# EAGLE design KSR_CDTV-SCSI30a (EAGLE 7.7.0)
REVISION: 0.1
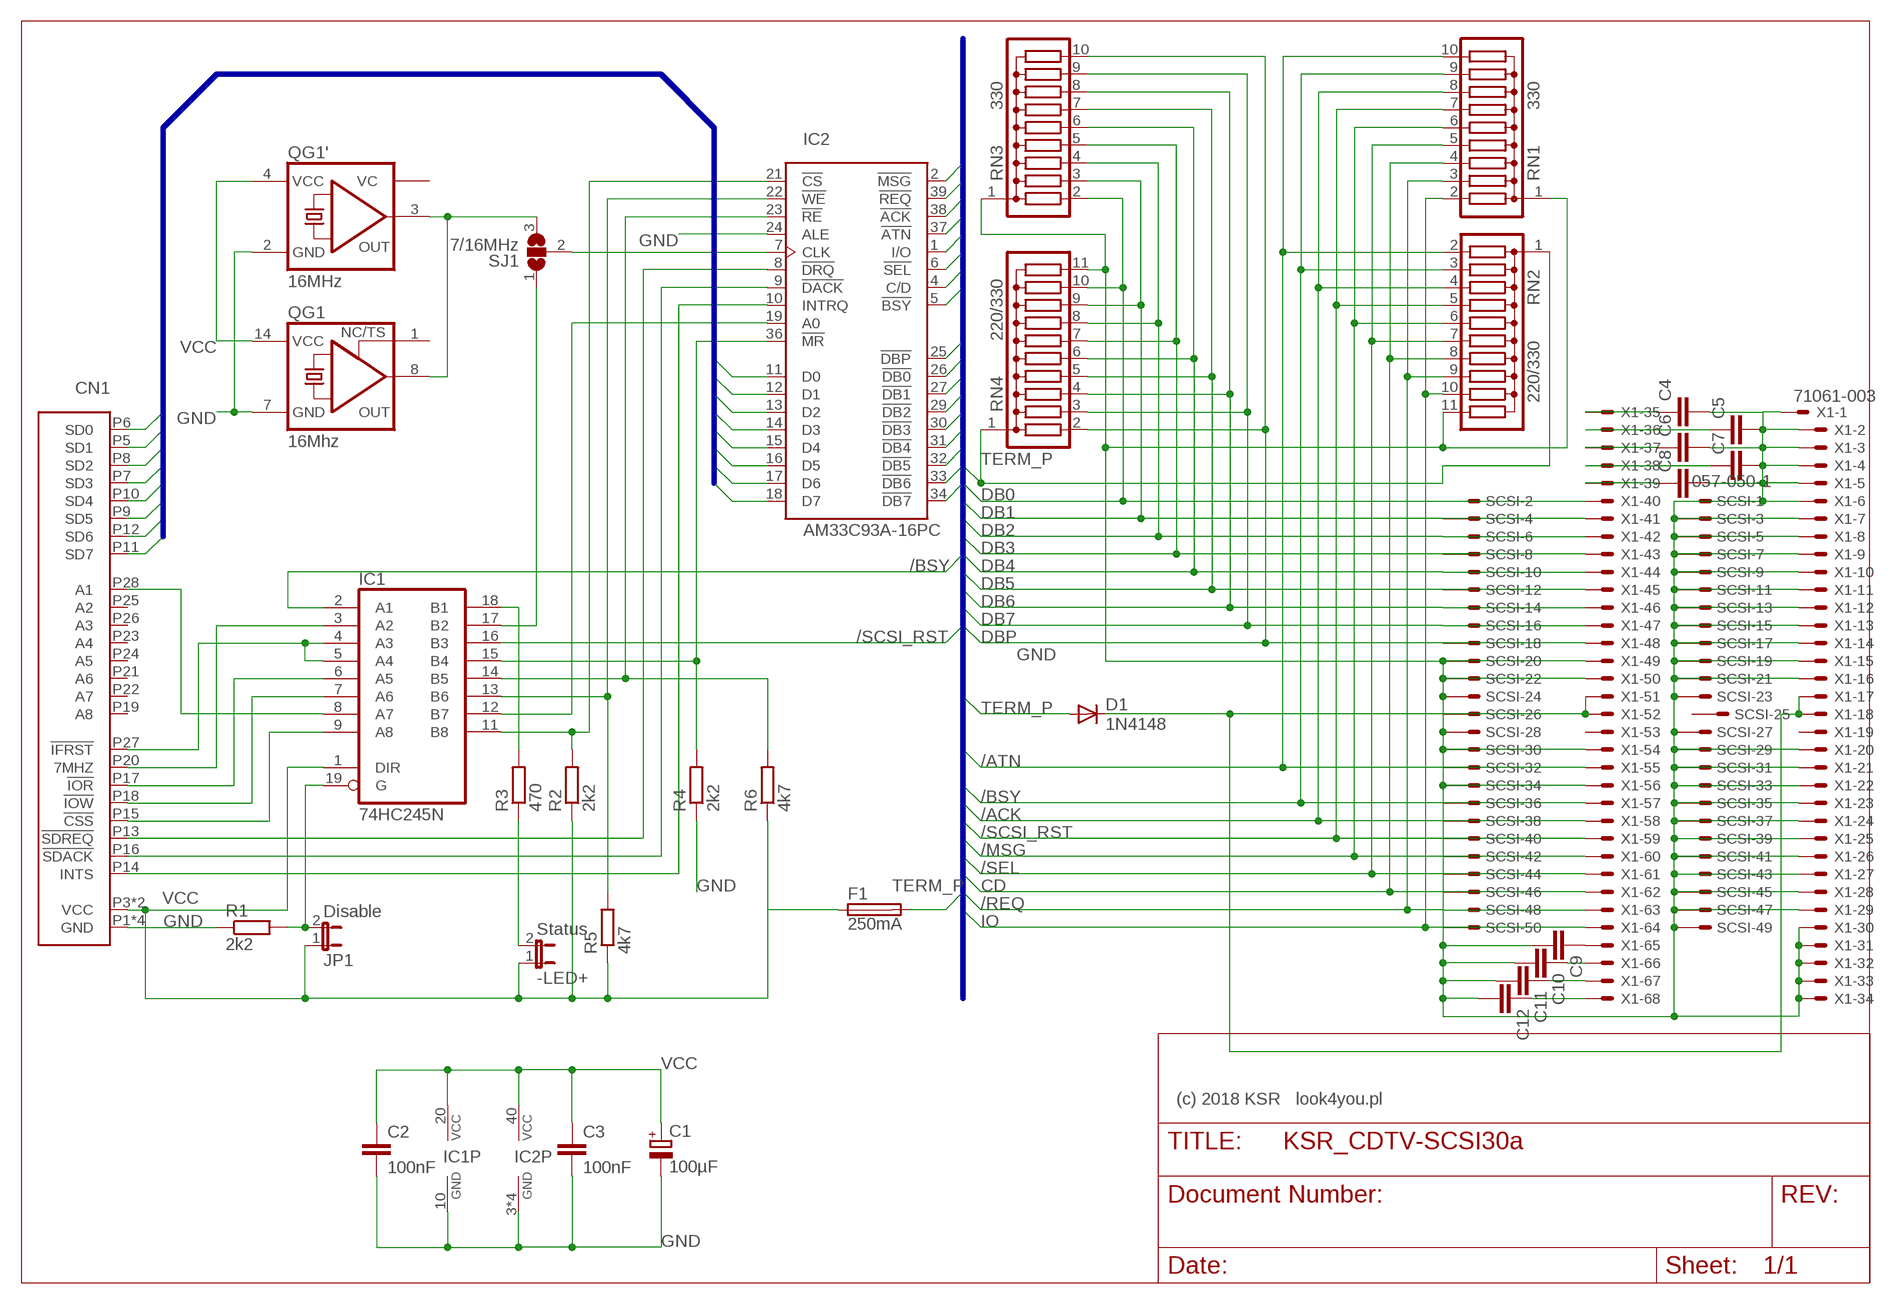
[diagram p0: schematic, sheet 1]

## Parts
-LED+  Status  JP1E  [JP1]
C1  100µF  CPOL-EUE2,5-6E  [E2,5-6E]
C2  100nF  C-EU050-025X075  [C050-025X075]
C3  100nF  C-EU050-025X075  [C050-025X075]
C4  C-EUC0603  [C0603]
C5  C-EUC0603  [C0603]
C6  C-EUC0603  [C0603]
C7  C-EUC0603  [C0603]
C8  C-EUC0603  [C0603]
C9  C-EUC0603  [C0603]
C10  C-EUC0603  [C0603]
C11  C-EUC0603  [C0603]
C12  C-EUC0603  [C0603]
CN1  CDTV-EXPANSION  [CDTV-SLOT]
D1  1N4148  1N4148DO35-7  [DO35-7]
F1  250mA  FUSETE5  [TE5]
IC1  74HC245N  [DIL20]
IC2  AM33C93A-16PC  WD33C93  [DIP40-6]
JP1  Disable  JP1E  [JP1]
QG1  16Mhz  XO-14  [DIL14S]
QG1'  16MHz  TCXO-CFPT-126  [7.0X5.0-4-PAD]
R1  2k2  R-EU_0207/7  [0207/7]
R2  2k2  R-EU_0207/7  [0207/7]
R3  470  R-EU_0207/7  [0207/7]
R4  2k2  R-EU_0207/7  [0207/7]
R5  4k7  R-EU_0207/7  [0207/7]
R6  4k7  R-EU_0207/7  [0207/7]
RN1  330  G09R  [SIL10]
RN2  220/330  G10R  [SIL11]
RN3  330  G09R  [SIL10]
RN4  220/330  G10R  [SIL11]
SCSI  057-050-1  [057-050-1]
SJ1  7/16MHz  SJ2W  [SJ_2]
X1  71061-003  [71061-0003]

## Nets
7MHZ: CN1.P20(7MHZ) IC1.3(A2)
/ACK: IC2.38(!ACK) RN1.8 RN2.4 SCSI.38 X1.58
/ATN: IC2.37(!ATN) RN1.10 RN2.2 SCSI.32 X1.55
/BSY: IC1.2(A1) IC2.5(!BSY) RN1.9 RN2.3 SCSI.36 X1.57
/BSY_B: -LED+.2 R3.1
/CS: IC1.11(B8) IC2.21(!CS) R2.2
/CSS: CN1.P15(!CSS) IC1.9(A8)
/ENABLE: IC1.19(G) JP1.2 R1.2
/IFRST: CN1.P27(!IFRST) IC1.4(A3) IC1.5(A4)
/INTS: CN1.P14(INTS) IC2.10(INTRQ)
/IOR: CN1.P17(!IOR) IC1.6(A5)
/IOW: CN1.P18(!IOW) IC1.7(A6)
/MR: IC1.15(B4) IC2.36(!MR) R4.2
/MSG: IC2.2(!MSG) RN1.6 RN2.6 SCSI.42 X1.60
/RE: IC1.14(B5) IC2.23(!RE) R6.2
/REQ: IC2.39(!REQ) RN1.3 RN2.9 SCSI.48 X1.63
/SCSI_RST: IC1.16(B3) RN1.7 RN2.5 SCSI.40 X1.59
/SDACK: CN1.P16(!SDACK) IC2.9(!DACK)
/SDREQ: CN1.P13(!SDREQ) IC2.8(!DRQ)
/SEL: IC2.6(!SEL) RN1.5 RN2.7 SCSI.44 X1.61
/WE: IC1.13(B6) IC2.22(!WE) R5.2
A1: CN1.P28(A1) IC1.8(A7)
B_A1: IC1.12(B7) IC2.19(A0)
CD: IC2.4(C/D) RN1.4 RN2.8 SCSI.46 X1.62
CLK: IC2.7(CLK) SJ1.2
CLK_7: IC1.17(B2) SJ1.1
CLK_16M: QG1'.3(OUT) QG1.8(OUT) SJ1.3
DB0: IC2.26(!DB0) RN3.2 RN4.10 SCSI.2 X1.40
DB1: IC2.27(!DB1) RN3.3 RN4.9 SCSI.4 X1.41
DB2: IC2.29(!DB2) RN3.4 RN4.8 SCSI.6 X1.42
DB3: IC2.30(!DB3) RN3.5 RN4.7 SCSI.8 X1.43
DB4: IC2.31(!DB4) RN3.6 RN4.6 SCSI.10 X1.44
DB5: IC2.32(!DB5) RN3.7 RN4.5 SCSI.12 X1.45
DB6: IC2.33(!DB6) RN3.8 RN4.4 SCSI.14 X1.46
DB7: IC2.34(!DB7) RN3.9 RN4.3 SCSI.16 X1.47
DBP: IC2.25(!DBP) RN3.10 RN4.2 SCSI.18 X1.48
GND: C1.- C2.2 C3.2 C4.2 C5.2 C6.2 C7.2 C8.2 C9.2 C10.2 C11.2 C12.2 CN1.P1(GND) CN1.P2(GND) CN1.P29(GND) CN1.P30(GND) IC1.10(GND) IC2.3(GND1) IC2.20(GND1) IC2.24(ALE) IC2.28(GND1) IC2.35(GND1) QG1'.2(GND) QG1.7(GND) R1.1 R4.1 RN1.1 RN2.11 RN3.1 RN4.11 SCSI.1 SCSI.3 SCSI.5 SCSI.7 SCSI.9 SCSI.11 SCSI.13 SCSI.15 SCSI.17 SCSI.19 SCSI.20 SCSI.21 SCSI.22 SCSI.23 SCSI.24 SCSI.27 SCSI.28 SCSI.29 SCSI.30 SCSI.31 SCSI.33 SCSI.34 SCSI.35 SCSI.37 SCSI.39 SCSI.41 SCSI.43 SCSI.45 SCSI.47 SCSI.49 X1.1 X1.2 X1.3 X1.4 X1.5 X1.6 X1.7 X1.8 X1.9 X1.10 X1.11 X1.12 X1.13 X1.14 X1.15 X1.16 X1.20 X1.21 X1.22 X1.23 X1.24 X1.25 X1.26 X1.27 X1.28 X1.29 X1.30 X1.31 X1.32 X1.33 X1.34 X1.49 X1.50 X1.54 X1.56
IO: IC2.1(I/O) RN1.2 RN2.10 SCSI.50 X1.64
N$1: IC1.18(B1) R3.2
N$2: D1.C SCSI.26 X1.17 X1.18 X1.51 X1.52
N$6: C9.1 X1.65
N$7: C10.1 X1.66
N$8: C11.1 X1.67
N$9: C12.1 X1.68
N$10: C8.1 X1.39
N$11: C7.1 X1.38
N$12: C6.1 X1.37
N$13: C5.1 X1.36
N$14: C4.1 X1.35
SD0: CN1.P6(SD0) IC2.11(D0)
SD1: CN1.P5(SD1) IC2.12(D1)
SD2: CN1.P8(SD2) IC2.13(D2)
SD3: CN1.P7(SD3) IC2.14(D3)
SD4: CN1.P10(SD4) IC2.15(D4)
SD5: CN1.P9(SD5) IC2.16(D5)
SD6: CN1.P12(SD6) IC2.17(D6)
SD7: CN1.P11(SD7) IC2.18(D7)
TERM_P: D1.A F1.2 RN2.1 RN4.1
VCC: -LED+.1 C1.+ C2.1 C3.1 CN1.P3(VCC) CN1.P4(VCC) F1.1 IC1.1(DIR) IC1.20(VCC) IC2.40(VCC1) JP1.1 QG1'.4(VCC) QG1.14(VCC) R2.1 R5.1 R6.1
Unconnected: CN1.P19(A8) CN1.P21(A6) CN1.P22(A7) CN1.P23(A4) CN1.P24(A5) CN1.P25(A2) CN1.P26(A3) QG1'.1(VC) QG1.1(TS) SCSI.25 X1.19 X1.53

## Buses
SD[0..7]
DB[0..7],/MSG,/REQ,/ACK,/ATN,IO,/SEL,CD,/BSY,DBP,TERM_P,/SCSI_RST

## Notes on the sheet
- (c) 2018 KSR   look4you.pl

## Library data of the parts
-LED+ JP1 = jumper:JP1E: JUMPER
C1 = rcl:CPOL-EU: POLARIZED CAPACITOR, European symbol
C2-C12 = rcl:C-EU: CAPACITOR, European symbol
CN1 = Amiga:CDTV-EXPANSION: Expansion Port for CDTV and A570
D1 = diode:1N4148: DIODE high speed (Philips)
F1 = fuse:FUSE: Fuse; OC_FARNELL: unknown; OC_NEWARK: unknown
IC1 = 74xx-eu:74*245: Octal BUS TRANSCEIVER, 3-state
IC2 = Amiga:WD33C93: WD33C93 -SCSI-Chip WD33C93A AM33C93 P16
QG1 = crystal:XO-: CRYSTAL; OC_FARNELL: unknown; OC_NEWARK: unknown
QG1' = IQD-Frequency-Products:TCXO: CRYSTAL RESONATOR
R1-R6 = rcl:R-EU_: RESISTOR, European symbol
RN1 RN3 = resistor-sil:G09R: SIL RESISTOR; OC_FARNELL: unknown; OC_NEWARK: unknown
RN2 RN4 = resistor-sil:G10R: SIL RESISTOR; OC_FARNELL: unknown; OC_NEWARK: unknown
SCSI = con-panduit:057-050-: CONNECTOR 50-pin series 057 contact pc board low profile headers; OC_FARNELL: unknown; OC_NEWARK: unknown
SJ1 = jumper:SJ2W: SMD solder JUMPER
X1 = con-molex:71061-003: CONNECTOR 68-pin 1.27mm (.050 inch) pitch SCSI+ unshielded receptacle right angle all plastic; OC_FARNELL: unknown; OC_NEWARK: unknown

## Board
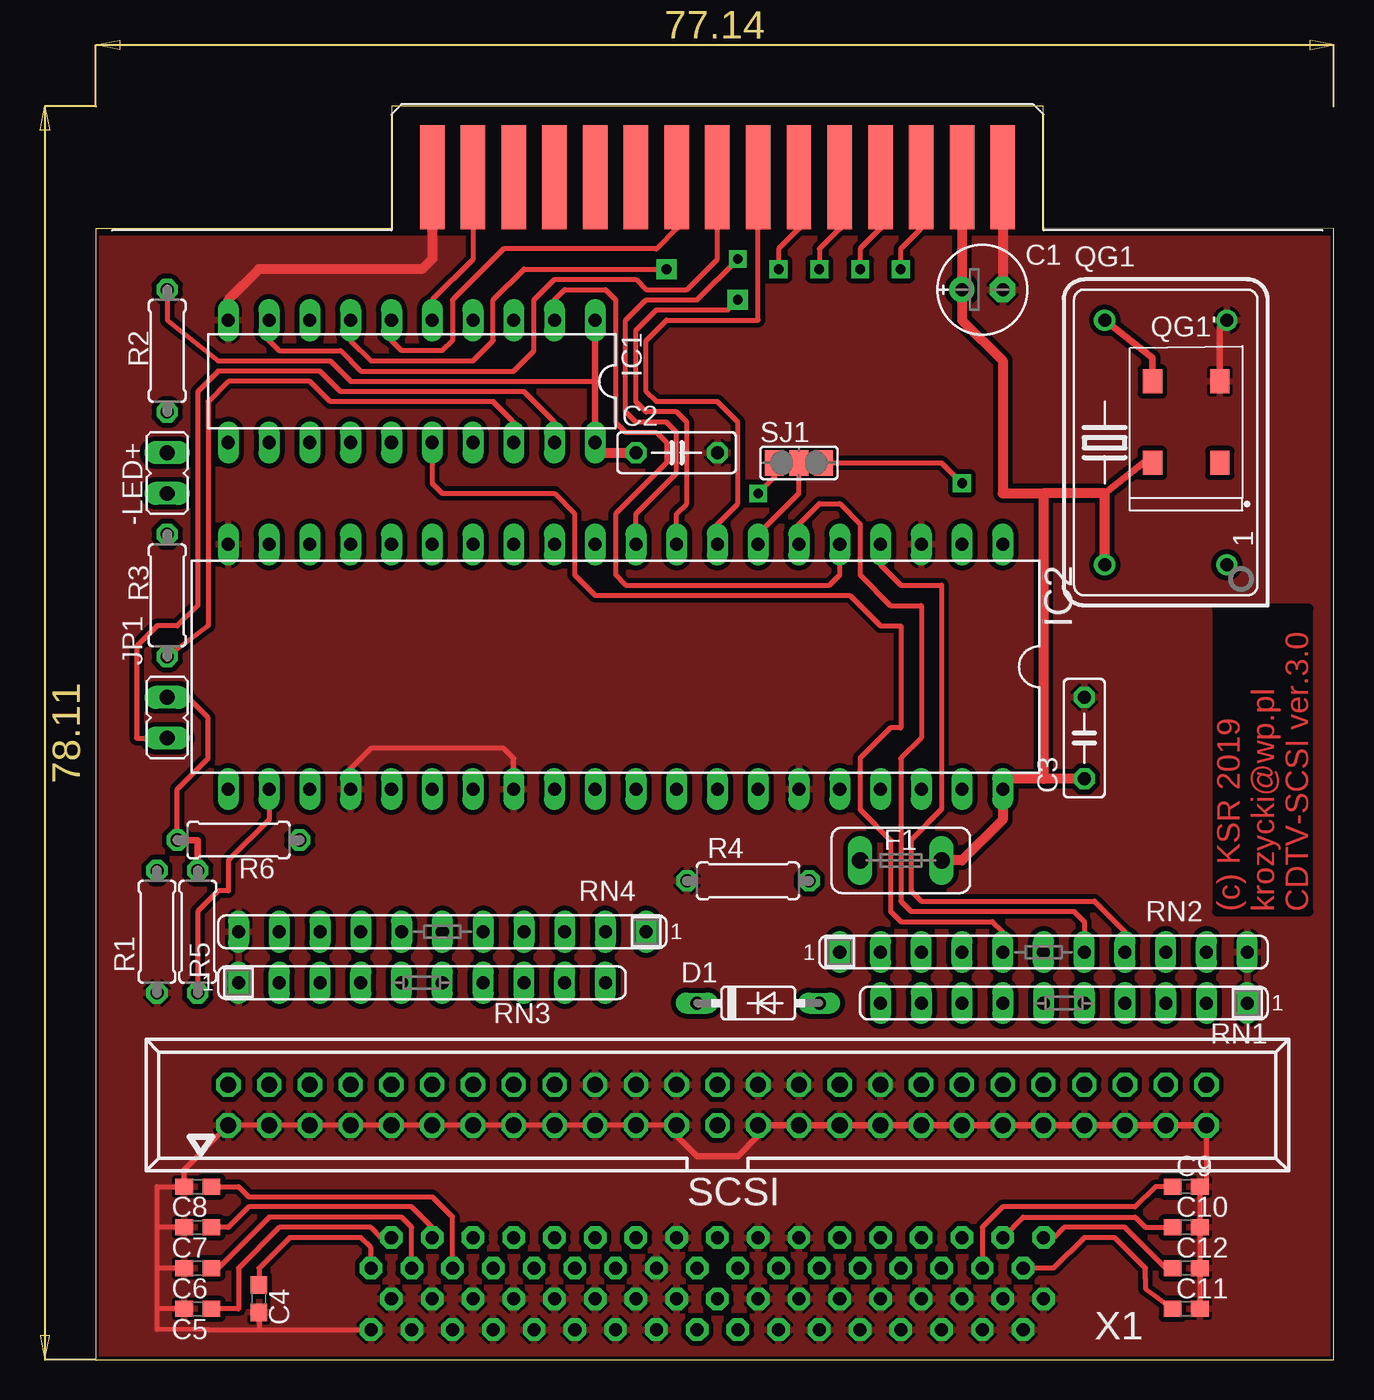
[diagram p1: board, top side]
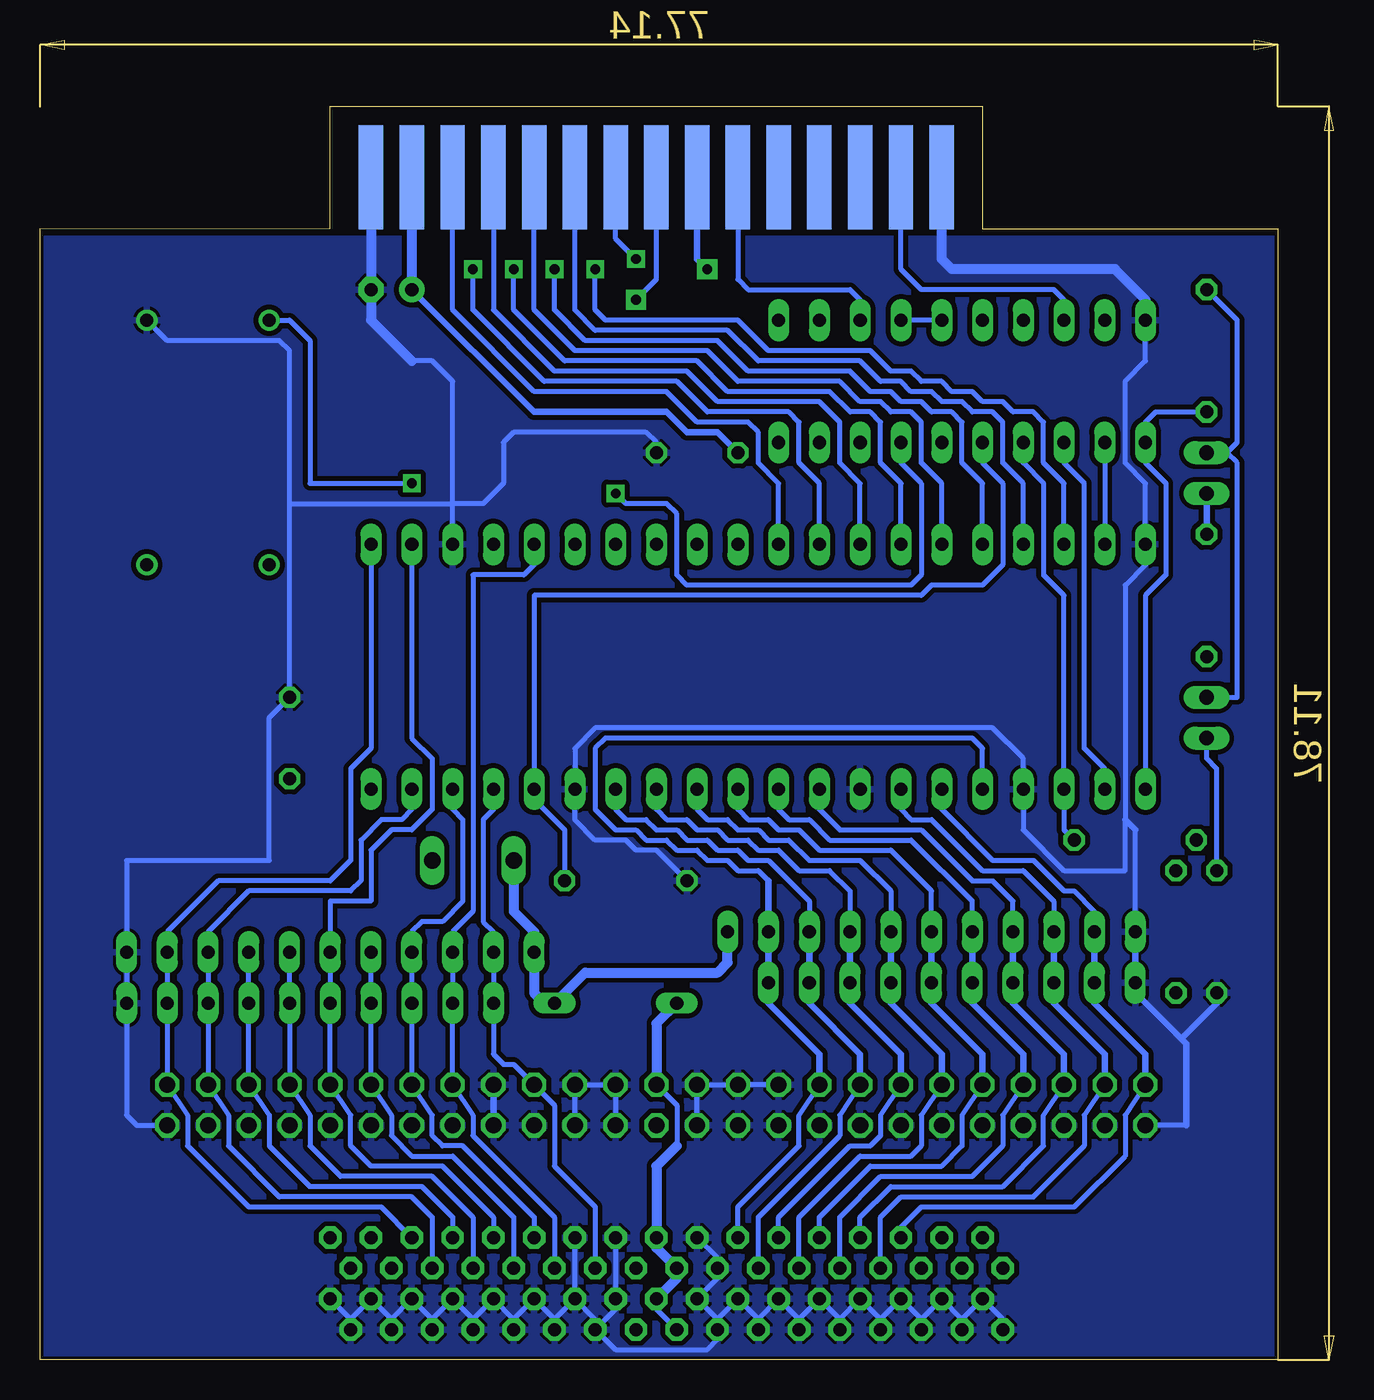
[diagram p2: board, bottom side, seen from below]

Size 77.14 x 78.11 mm. Coordinates in mm from the lower left corner, seen from the top.
Outline: 0,0 77.14,0 77.14,70.47 59.05,70.48 59.05,78.11 18.41,78.11 18.41,70.47 0,70.47 0,0
Copper layers (1*16): Top 0.035mm / dielectric 1.5mm / Bottom 0.035mm
Design rules "default *": minimum track width 10mil, minimum drill 19mil, track to track 12mil, track to pad 12mil, pad to pad 12mil, via to via 12mil, smd to smd 12mil, copper to edge 8mil, drill to drill 8mil, minimum pad ring 10mil, minimum via ring 10mil, stop-mask expansion 4mil, vias tented up to drill 0mil, thermal gap 8mil

### Footprints (pad centres in the part's own frame; a part is rotated, then mirrored left to right if it is on the bottom)
JP1 = drill 0.914 long: 1 0,-1.27; 2 0,1.27
E2,5-6E = drill 0.813 pad 1.575: + -1.27,0 | drill 0.813 pad 1.575 octagon: - 1.27,0
C050-025X075 = drill 0.813 octagon: 1 -2.54,0; 2 2.54,0
C0603 = smd 1.1 x 1: 1 -0.85,0; 2 0.85,0
CDTV-SLOT = smd 1.524 x 6.477: P1 -17.78,-2.54; P3 -15.24,-2.54; P5 -12.7,-2.54; P7 -10.16,-2.54; P9 -7.62,-2.54; P11 -5.08,-2.54; P13 -2.54,-2.54; P15 0,-2.54; P17 2.54,-2.54; P19 5.08,-2.54; P21 7.62,-2.54; P23 10.16,-2.54; P25 12.7,-2.54; P27 15.24,-2.54; P29 17.78,-2.54 | smd 1.524 x 6.477 bottom: P2 -17.78,-2.54; P4 -15.24,-2.54; P6 -12.7,-2.54; P8 -10.16,-2.54; P10 -7.62,-2.54; P12 -5.08,-2.54; P14 -2.54,-2.54; P16 0,-2.54; P18 2.54,-2.54; P20 5.08,-2.54; P22 7.62,-2.54; P24 10.16,-2.54; P26 12.7,-2.54; P28 15.24,-2.54; P30 17.78,-2.54
DO35-7 = drill 0.813 long: A 3.81,0; C -3.81,0
TE5 = drill 1.016 long: 1 -2.54,0; 2 2.54,0
DIL20 = drill 0.813 long: 1 -11.43,-3.81; 2 -8.89,-3.81; 3 -6.35,-3.81; 4 -3.81,-3.81; 5 -1.27,-3.81; 6 1.27,-3.81; 7 3.81,-3.81; 8 6.35,-3.81; 9 8.89,-3.81; 10 11.43,-3.81; 11 11.43,3.81; 12 8.89,3.81; 13 6.35,3.81; 14 3.81,3.81; 15 1.27,3.81; 16 -1.27,3.81; 17 -3.81,3.81; 18 -6.35,3.81; 19 -8.89,3.81; 20 -11.43,3.81
DIP40-6 = drill 0.813 long: 1 -24.13,-7.62; 2 -21.59,-7.62; 3 -19.05,-7.62; 4 -16.51,-7.62; 5 -13.97,-7.62; 6 -11.43,-7.62; 7 -8.89,-7.62; 8 -6.35,-7.62; 9 -3.81,-7.62; 10 -1.27,-7.62; 11 1.27,-7.62; 12 3.81,-7.62; 13 6.35,-7.62; 14 8.89,-7.62; 15 11.43,-7.62; 16 13.97,-7.62; 17 16.51,-7.62; 18 19.05,-7.62; 19 21.59,-7.62; 20 24.13,-7.62; 21 24.13,7.62; 22 21.59,7.62; 23 19.05,7.62; 24 16.51,7.62; 25 13.97,7.62; 26 11.43,7.62; 27 8.89,7.62; 28 6.35,7.62; 29 3.81,7.62; 30 1.27,7.62; 31 -1.27,7.62; 32 -3.81,7.62; 33 -6.35,7.62; 34 -8.89,7.62; 35 -11.43,7.62; 36 -13.97,7.62; 37 -16.51,7.62; 38 -19.05,7.62; 39 -21.59,7.62; 40 -24.13,7.62
DIL14S = drill 0.813: 1 -7.62,-3.81; 7 7.62,-3.81; 8 7.62,3.81; 14 -7.62,3.81
7.0X5.0-4-PAD = smd 1.5 x 1.2: 1 -2.54,-2.1; 2 2.54,-2.1; 3 2.54,2.1; 4 -2.54,2.1
0207/7 = drill 0.813 octagon: 1 -3.81,0; 2 3.81,0
SIL10 = drill 0.813 long: 1 -11.43,0; 2 -8.89,0; 3 -6.35,0; 4 -3.81,0; 5 -1.27,0; 6 1.27,0; 7 3.81,0; 8 6.35,0; 9 8.89,0; 10 11.43,0
SIL11 = drill 0.813 long: 1 -12.7,0; 2 -10.16,0; 3 -7.62,0; 4 -5.08,0; 5 -2.54,0; 6 0,0; 7 2.54,0; 8 5.08,0; 9 7.62,0; 10 10.16,0; 11 12.7,0
057-050-1 = drill 1 octagon: 1 -30.48,-1.27; 2 -30.48,1.27; 3 -27.94,-1.27; 4 -27.94,1.27; 5 -25.4,-1.27; 6 -25.4,1.27; 7 -22.86,-1.27; 8 -22.86,1.27; 9 -20.32,-1.27; 10 -20.32,1.27; 11 -17.78,-1.27; 12 -17.78,1.27; 13 -15.24,-1.27; 14 -15.24,1.27; 15 -12.7,-1.27; 16 -12.7,1.27; 17 -10.16,-1.27; 18 -10.16,1.27; 19 -7.62,-1.27; 20 -7.62,1.27; 21 -5.08,-1.27; 22 -5.08,1.27; 23 -2.54,-1.27; 24 -2.54,1.27; 25 0,-1.27; 26 0,1.27; 27 2.54,-1.27; 28 2.54,1.27; 29 5.08,-1.27; 30 5.08,1.27; 31 7.62,-1.27; 32 7.62,1.27; 33 10.16,-1.27; 34 10.16,1.27; 35 12.7,-1.27; 36 12.7,1.27; 37 15.24,-1.27; 38 15.24,1.27; 39 17.78,-1.27; 40 17.78,1.27; 41 20.32,-1.27; 42 20.32,1.27; 43 22.86,-1.27; 44 22.86,1.27; 45 25.4,-1.27; 46 25.4,1.27; 47 27.94,-1.27; 48 27.94,1.27; 49 30.48,-1.27; 50 30.48,1.27
SJ_2 = smd 1.168 x 1.6: 1 -1.524,0; 2 0,0; 3 1.524,0
71061-0003 = drill 0.813 pad 1.397 octagon: 1 -20.955,-5.73; 2 -19.685,-3.82; 3 -18.415,-5.73; 4 -17.145,-3.82; 5 -15.875,-5.73; 6 -14.605,-3.82; 7 -13.335,-5.73; 8 -12.065,-3.82; 9 -10.795,-5.73; 10 -9.525,-3.82; 11 -8.255,-5.73; 12 -6.985,-3.82; 13 -5.715,-5.73; 14 -4.445,-3.82; 15 -3.175,-5.73; 16 -1.905,-3.82; 17 -0.635,-5.73; 18 0.635,-3.82; 19 1.905,-5.73; 20 3.175,-3.82; 21 4.445,-5.73; 22 5.715,-3.82; 23 6.985,-5.73; 24 8.255,-3.82; 25 9.525,-5.73; 26 10.795,-3.82; 27 12.065,-5.73; 28 13.335,-3.82; 29 14.605,-5.73; 30 15.875,-3.82; 31 17.145,-5.73; 32 18.415,-3.82; 33 19.685,-5.73; 34 20.955,-3.82; 35 -20.955,-1.91; 36 -19.685,0; 37 -18.415,-1.91; 38 -17.145,0; 39 -15.875,-1.91; 40 -14.605,0; 41 -13.335,-1.91; 42 -12.065,0; 43 -10.795,-1.91; 44 -9.525,0; 45 -8.255,-1.91; 46 -6.985,0; 47 -5.715,-1.91; 48 -4.445,0; 49 -3.175,-1.91; 50 -1.905,0; 51 -0.635,-1.91; 52 0.635,0; 53 1.905,-1.91; 54 3.175,0; 55 4.445,-1.91; 56 5.715,0; 57 6.985,-1.91; 58 8.255,0; 59 9.525,-1.91; 60 10.795,0; 61 12.065,-1.91; 62 13.335,0; 63 14.605,-1.91; 64 15.875,0; 65 17.145,-1.91; 66 18.415,0; 67 19.685,-1.91; 68 20.955,0

### Placement (x,y rotation side)
-LED+  4.45,55.24 180 top
C1  55.24,66.67 0 top
C2  36.2,56.52 0 top
C3  61.59,38.73 90 top
C4  10.16,3.81 270 top
C5  6.35,3.17 180 top
C6  6.35,5.71 180 top
C7  6.35,8.26 180 top
C8  6.35,10.79 180 top
C9  67.94,10.79 0 top
C10  67.94,8.26 0 top
C11  67.94,3.17 0 top
C12  67.94,5.71 0 top
CN1  38.73,71.12 180 top
D1  41.27,22.23 0 top
F1  50.16,31.11 180 top
IC1  19.68,60.96 180 top
IC2  32.38,43.18 180 top
JP1  4.45,40.01 180 top
QG1  66.67,57.15 90 top
QG1'  67.94,58.42 90 top
R1  3.81,26.67 90 top
R2  4.45,62.87 270 top
R3  4.45,47.62 270 top
R4  40.64,29.84 0 top
R5  6.35,26.67 270 top
R6  8.89,32.38 0 top
RN1  60.33,22.23 180 top
RN2  59.05,25.4 0 top
RN3  20.32,23.5 0 top
RN4  21.59,26.67 180 top
SCSI  38.73,15.88 0 top
SJ1  43.81,55.88 0 top
X1  38.1,7.62 0 top

### Tracks (layer width: path | path; a pad name or v marks a point on that pad's centre or on a via)
7MHZ
  Bottom 0.305: 33.66,71.12 33.66,67.31 33.02,66.67 26.67,66.67 26.04,66.04 IC1.3
  Bottom 0.406: CN1.P20 33.66,71.12
/ACK
  Bottom 0.305: IC2.38 51.44,34.29 50.8,33.66 50.8,28.57 52.07,27.3 53.34,27.3 53.98,26.67 RN2.4 RN1.8 SCSI.38 52.7,15.24 52.7,13.97 52.07,13.34 50.8,13.34 46.35,8.89 X1.58
/ATN
  Bottom 0.305: IC2.37 48.9,34.29 49.53,33.66 49.53,27.3 48.9,26.67 RN2.2 RN1.10 48.9,19.05 48.26,18.41 47.62,18.41 SCSI.32 45.09,15.88 45.09,12.06 42.55,9.53 X1.55
/BSY
  Top 0.305: IC1.2 28.57,66.04 29.21,66.67 31.75,66.67 32.38,66.04 32.38,58.42 33.02,57.78 34.92,57.78 35.56,57.15 35.56,55.88 32.38,52.7 32.38,48.9 33.02,48.26 45.72,48.26 46.35,48.9 IC2.5
  Bottom 0.305: IC2.5 46.35,49.53 46.99,48.9 50.16,48.9 50.16,27.94 51.44,26.67 RN2.3 RN1.9 SCSI.36 50.16,15.24 50.16,13.97 45.09,8.89 X1.57
/BSY_B
  Bottom 0.406: R3.1 -LED+.2
/CS
  Bottom 0.305: IC2.21 8.26,47.62 6.99,48.9 6.99,54.61 8.26,55.88 IC1.11 8.26,58.42 7.62,59.05 R2.2
/CSS
  Top 0.305: IC1.9 10.79,63.5 11.43,62.87 15.24,62.87 16.51,61.59 26.04,61.59 27.3,62.87 27.3,66.04 28.57,67.31 33.66,67.31 34.29,66.67 36.83,66.67 38.73,68.58 CN1.P15
/ENABLE
  Top 0.305: IC1.19 28.57,58.42 26.67,60.33 15.24,60.33 13.97,61.59 7.62,61.59 6.35,60.33 6.35,46.99 5.08,45.72 3.81,45.72 2.54,44.45 2.54,38.73 JP1.2
  Bottom 0.305: R1.2 3.81,36.83 4.45,37.47 JP1.2
/IFRST
  Top 0.305: CN1.P27 23.5,68.58 20.95,66.04 IC1.5
  Bottom 0.305: IC1.5 IC1.4
/INTS  (via drill 0.6)
  Top 0.305: IC2.10 33.66,52.7 36.2,55.24 36.2,57.78 35.56,58.42 33.66,58.42 33.02,59.05 33.02,64.77 34.29,66.04 37.47,66.04 v40.01,68.58
  Bottom 0.305: v40.01,68.58 41.27,69.85 CN1.P14
/IOR
  Top 0.305: 36.2,70.48 34.92,69.22 25.4,69.22 22.23,66.04 22.23,63.5 21.59,62.87 19.05,62.87 18.41,63.5 IC1.6
  Top 0.406: CN1.P17 36.2,70.48
/IOW  (via drill 0.6 pad 1.27)
  Top 0.305: IC1.7 15.88,63.5 17.14,62.23 23.5,62.23 24.77,63.5 24.77,66.04 26.67,67.94 v35.56,67.94
  Bottom 0.406: CN1.P18 36.2,68.58 v35.56,67.94
/MR
  Bottom 0.305: R4.2 44.45,33.02 46.35,34.92 IC2.36 46.35,47.62 22.23,47.62 21.59,48.26 18.41,48.26 17.14,49.53 17.14,54.61 18.41,55.88 IC1.15
/MSG
  Bottom 0.305: IC2.2 53.98,38.73 52.7,37.47 52.7,34.29 53.98,33.02 55.24,33.02 56.52,31.75 56.52,28.57 59.05,28.57 RN2.6 RN1.6 SCSI.42 57.78,15.24 57.78,13.34 56.52,12.06 52.07,12.06 48.9,8.89 X1.60
/RE
  Bottom 0.305: IC1.14 15.88,55.88 14.61,54.61 14.61,48.9 13.34,47.62 IC2.23 13.34,33.02 R6.2
/REQ
  Bottom 0.305: IC2.39 53.98,34.29 54.61,33.66 55.88,33.66 57.15,32.38 57.15,29.84 57.78,29.21 64.14,29.21 66.67,26.67 RN2.9 RN1.3 SCSI.48 65.41,15.24 65.41,13.34 62.23,10.16 53.98,10.16 52.7,8.89 X1.63
/SCSI_RST
  Top 0.305: IC1.16 20.95,54.61 21.59,53.98 28.57,53.98 29.84,52.7 29.84,48.9 31.11,47.62 46.99,47.62 48.9,45.72 50.16,45.72 50.16,39.37 49.53,39.37 47.62,37.47 47.62,34.29 49.53,32.38 49.53,27.94 50.16,27.3 55.88,27.3 56.52,26.67 RN2.5
  Bottom 0.305: RN2.5 RN1.7 SCSI.40 55.24,15.24 55.24,13.97 53.98,12.7 51.44,12.7 47.62,8.89 X1.59
/SDACK  (via drill 0.6 pad 1.27)
  Top 0.305: IC2.9 36.2,52.7 36.83,53.34 36.83,58.42 36.2,59.05 34.29,59.05 33.66,59.69 33.66,64.14 34.92,65.41 39.37,65.41 v40.01,66.04
  Bottom 0.305: v40.01,66.04 38.73,67.31 CN1.P16
/SDREQ
  Top 0.305: IC2.8 38.73,52.07 40.01,53.34 40.01,58.42 38.73,59.69 34.92,59.69 34.29,60.33 34.29,63.5 35.56,64.77 41.27,64.77 CN1.P13
/SEL
  Top 0.305: IC2.6 43.81,52.07 45.09,53.34 46.35,53.34 47.62,52.07 47.62,48.9 49.53,46.99 51.44,46.99 51.44,38.73 50.16,37.47 50.16,28.57 50.8,27.94 60.96,27.94 61.59,27.3 RN2.7
  Bottom 0.305: RN2.7 RN1.5 SCSI.44 60.33,15.24 60.33,13.34 58.42,11.43 52.7,11.43 50.16,8.89 X1.61
/WE
  Top 0.305: IC2.22 10.79,33.66 8.26,31.11 8.26,29.21 7.62,29.21 6.35,27.94 R5.2
  Bottom 0.305: IC1.13 13.34,55.88 12.06,54.61 12.06,38.1 10.79,36.83 IC2.22
A1
  Bottom 0.305: IC1.8 13.34,66.04 13.97,66.67 22.23,66.67 23.5,67.94 CN1.P28
B_A1
  Bottom 0.305: IC1.12 IC2.19
CD
  Top 0.305: IC2.4 48.9,49.53 50.16,48.26 52.7,48.26 52.7,34.29 50.8,32.38 50.8,29.21 51.44,28.57 62.23,28.57 64.14,26.67 RN2.8
  Bottom 0.305: RN2.8 RN1.4 SCSI.46 62.87,15.24 62.87,13.34 60.33,10.79 53.34,10.79 51.44,8.89 X1.62
CLK
  Top 0.305: IC2.7 41.27,51.44 43.81,53.98 SJ1.2
CLK_7  (via drill 0.6)
  Top 0.305: SJ1.1 42.29,54.99 v41.27,53.98
  Bottom 0.305: v41.27,53.98 40.64,53.34 38.1,53.34 37.47,52.7 37.47,48.9 36.83,48.26 22.86,48.26 22.23,48.9 22.23,54.61 23.5,55.88 IC1.17
CLK_16M  (via drill 0.6)
  Top 0.305: v53.98,54.61 52.7,55.88 SJ1.3
  Top 0.406: QG1'.3 65.84,62.42 QG1.8
  Bottom 0.305: QG1.8 61.59,64.77 60.33,63.5 60.33,54.61 v53.98,54.61
DB0
  Bottom 0.305: IC2.26 20.95,34.29 17.78,31.11 15.24,31.11 13.34,29.21 12.7,29.21 11.43,27.94 RN4.10 | SCSI.2 9.53,15.24 9.53,12.7 12.7,9.53 22.23,9.53 23.5,8.26 X1.40
  Bottom 0.406: SCSI.2 8.26,19.05 11.43,22.23 RN3.2 RN4.10
DB1
  Bottom 0.305: IC2.27 23.5,34.29 22.86,33.66 21.59,33.66 18.41,30.48 15.88,30.48 13.97,28.57 RN4.9 | SCSI.4 12.06,15.24 12.06,13.34 15.24,10.16 23.5,10.16 24.77,8.89 X1.41
  Bottom 0.406: SCSI.4 10.79,19.05 13.97,22.23 RN3.3 RN4.9
DB2
  Bottom 0.305: IC2.29 28.57,34.29 27.3,33.02 22.23,33.02 19.05,29.84 17.78,29.84 16.51,28.57 RN4.8 | SCSI.6 14.61,15.24 14.61,13.34 17.14,10.79 24.13,10.79 26.04,8.89 X1.42
  Bottom 0.406: SCSI.6 13.34,19.05 16.51,22.23 RN3.4 RN4.8
DB3
  Bottom 0.305: IC2.30 31.11,34.29 30.48,33.66 29.21,33.66 27.94,32.38 22.86,32.38 19.05,28.57 RN4.7 | SCSI.8 17.14,15.24 17.14,13.34 19.05,11.43 24.77,11.43 27.3,8.89 X1.43
  Bottom 0.406: SCSI.8 15.88,19.05 19.05,22.23 RN3.5 RN4.7
DB4
  Bottom 0.305: IC2.31 33.66,34.29 33.02,33.66 31.75,33.66 31.11,33.02 29.84,33.02 28.57,31.75 24.13,31.75 21.59,29.21 RN4.6 | SCSI.10 19.68,15.24 19.68,13.34 20.95,12.06 25.4,12.06 28.57,8.89 X1.44
  Bottom 0.406: SCSI.10 18.41,19.05 21.59,22.23 RN3.6 RN4.6
DB5
  Bottom 0.305: IC2.32 36.2,34.29 35.56,33.66 34.29,33.66 33.66,33.02 32.38,33.02 31.75,32.38 30.48,32.38 29.21,31.11 26.04,31.11 24.13,29.21 RN4.5 | SCSI.12 22.23,15.24 22.23,13.34 22.86,12.7 26.04,12.7 29.53,9.21 29.84,8.89 X1.45
  Bottom 0.406: SCSI.12 20.95,19.05 24.13,22.23 RN3.7 RN4.5
DB6
  Bottom 0.305: IC2.33 38.73,34.29 38.1,33.66 36.83,33.66 36.2,33.02 34.92,33.02 34.29,32.38 33.02,32.38 32.38,31.75 31.11,31.75 29.84,30.48 27.94,30.48 26.67,29.21 RN4.4 | SCSI.14 24.77,15.24 24.77,13.97 25.4,13.34 26.67,13.34 31.11,8.89 X1.46
  Bottom 0.406: SCSI.14 23.5,19.05 26.67,22.23 RN3.8 RN4.4
DB7
  Bottom 0.305: IC2.34 41.27,34.29 40.64,33.66 39.37,33.66 38.73,33.02 37.47,33.02 36.83,32.38 35.56,32.38 34.92,31.75 33.66,31.75 33.02,31.11 31.75,31.11 29.21,28.57 RN4.3 | SCSI.16 27.3,15.24 27.3,13.97 32.38,8.89 X1.47
  Bottom 0.406: SCSI.16 26.04,19.05 29.21,22.23 RN3.9 RN4.3
DBP
  Bottom 0.305: IC2.25 18.41,38.1 19.05,38.73 41.91,38.73 42.55,38.1 42.55,34.29 41.27,33.02 40.01,33.02 39.37,32.38 38.1,32.38 37.47,31.75 36.2,31.75 35.56,31.11 34.29,31.11 33.66,30.48 32.38,30.48 31.75,29.84 | SCSI.18 29.84,15.24 29.84,13.34 33.66,9.53 X1.48
  Bottom 0.406: SCSI.18 28.57,19.05 31.75,22.23 RN3.10 RN4.2 31.75,29.84
GND
  Top 0.305: SCSI.23 SCSI.21 SCSI.19 SCSI.17 SCSI.15 SCSI.13 SCSI.11 SCSI.9 SCSI.7 SCSI.5 SCSI.3 SCSI.1 5.5,11.85 C8.2 3.81,10.79 3.81,8.26 | IC2.28 26.04,37.47 25.4,38.1 17.14,38.1 15.88,36.83 IC2.24 | 3.81,3.17 3.81,1.91 7,1.89 10.16,1.89 | 3.81,3.17 3.81,5.71 | 3.81,5.71 3.81,8.26 | C7.2 3.81,8.26 | C6.2 3.81,5.71 | C5.2 3.81,3.17 | SCSI.49 69.22,10.79 C9.2 C10.2 C12.2 C11.2 | 10.16,1.89 X1.1 | C4.2 10.16,1.89
  Top 0.406: QG1'.2 70.05,64.33 QG1.7 | SCSI.23 36.2,13.97 37.47,12.7 40.01,12.7 41.27,13.97 SCSI.27 SCSI.45 | SCSI.45 SCSI.43 SCSI.41 SCSI.39 SCSI.37 SCSI.35 SCSI.33 SCSI.31 SCSI.29 | SCSI.49 SCSI.47 SCSI.45
  Top 0.61: CN1.P2 C1.- | CN1.P30 20.95,68.58 20.32,67.94 10.16,67.94 8.26,66.04 IC1.10
  Bottom 0.305: QG1.7 69.22,63.5 62.23,63.5 61.59,62.87 61.59,53.34 | C2.2 38.73,57.15 39.37,57.78 47.62,57.78 48.26,57.15 48.26,54.61 49.53,53.34 51.44,53.34 | IC2.3 51.44,53.34 | 51.44,53.34 51.44,60.96 52.7,62.23 53.98,62.23 | SCSI.49 71.12,14.61 71.75,15.24 RN1.1 RN2.11 71.75,31.11 62.87,31.11 62.87,40.01 C3.2 61.59,53.34 | SCSI.29 SCSI.30 SCSI.28 SCSI.27 | 36.2,13.97 SCSI.23 SCSI.24 SCSI.22 SCSI.20 | 5.71,14.61 SCSI.1 | IC1.10 8.26,62.23 9.53,60.96 9.53,55.88 8.26,54.61 IC2.20 8.26,49.53 9.53,48.26 9.53,33.66 9.53,30.48 13.34,30.48 15.88,33.02 IC2.24 15.88,37.47 17.78,39.37 42.55,39.37 43.81,38.1 IC2.35 43.81,33.66 42.55,32.38 40.64,32.38 40.01,31.75 38.73,31.75 R4.1 | 61.59,53.34 51.44,53.34 | RN4.11 8.89,33.02 | X1.1 17.14,2.53 X1.2 19.68,2.53 | X1.3 19.68,2.53 | 19.68,2.53 X1.4 22.23,2.53 | X1.5 22.23,2.53 | 22.23,2.53 X1.6 24.77,2.53 | X1.7 24.77,2.53 | 24.77,2.53 X1.8 27.3,2.53 | X1.9 27.3,2.53 | 27.3,2.53 X1.10 29.84,2.53 | X1.11 29.84,2.53 | 29.84,2.53 X1.12 32.38,2.53 | X1.13 32.38,2.53 | 32.38,2.53 X1.14 34.92,2.53 | 34.92,2.53 X1.15 34.92,1.27 35.56,0.64 41.27,0.64 42.53,1.89 X1.21 | 34.92,2.53 X1.16 34.92,5.08 X1.49 34.92,6.35 X1.50 | X1.21 41.27,3.16 X1.20 X1.54 | X1.21 42.55,2.53 X1.22 | X1.23 45.09,2.53 | 45.09,2.53 X1.22 | X1.22 X1.56 | 45.09,2.53 X1.24 47.62,2.53 | X1.25 47.62,2.53 | 47.62,2.53 X1.26 50.16,2.53 | X1.27 50.16,2.53 | 50.16,2.53 X1.28 52.7,2.53 | X1.29 52.7,2.53 | 52.7,2.53 X1.30 55.24,2.53 | X1.31 55.24,2.53 | 55.24,2.53 X1.32 57.78,2.53 | X1.33 57.78,2.53 | 57.78,2.53 X1.34
  Bottom 0.406: RN4.11 RN3.1 8.89,22.86 6.03,20 | 5.71,14.61 5.71,19.68 6.03,20 | R1.1 3.81,22.23 6.03,20 | 8.89,33.02 9.53,33.66 | SCSI.33 SCSI.34
  Bottom 0.61: 53.98,62.23 56.52,64.77 C1.- CN1.P2 | IC1.10 8.26,66.04 10.16,67.94 20.32,67.94 20.95,68.58 CN1.P30
  pour Bottom: 0,0 76.83,0 76.83,69.85 0,69.85
  pour Top: 0,0 76.83,0 76.83,69.85 0,69.85
IO
  Bottom 0.305: IC2.1 56.52,38.1 57.78,36.83 57.78,31.11 59.05,29.84 66.04,29.84 69.22,26.67 RN2.10 RN1.2 SCSI.50 67.94,15.24 67.94,13.34 64.14,9.53 55.88,9.53 X1.64
N$1
  Top 0.305: IC1.18 26.04,58.42 24.77,59.69 14.61,59.69 13.34,60.96 8.26,60.96 6.99,59.69 6.99,45.72 R3.2
N$2
  Bottom 0.305: SCSI.26 37.47,15.88 37.47,13.34 | X1.52 38.73,6.98 | X1.51 37.47,5.07 | X1.18 38.73,3.16 X1.17
  Bottom 0.61: D1.C 38.73,20.95 SCSI.26 | 37.47,13.34 38.73,12.06 X1.52 | 38.73,6.98 X1.51 | 37.47,5.07 X1.18
N$6
  Top 0.305: C9.1 66.04,10.79 64.77,9.53 56.52,9.53 55.24,8.26 X1.65
N$7
  Top 0.305: C10.1 65.41,8.26 64.77,8.89 57.78,8.89 X1.66
N$8
  Top 0.305: C11.1 65.41,4.45 65.4,5.08 65.41,5.08 65.41,5.71 63.5,7.62 61.59,7.62 59.69,5.71 X1.67
N$9
  Top 0.305: C12.1 66.67,5.71 64.77,7.62 64.14,8.26 60.33,8.26 59.69,7.62 X1.68
N$10
  Top 0.305: C8.1 8.89,10.79 9.53,10.16 20.95,10.16 22.23,8.89 X1.39
N$11
  Top 0.305: C7.1 8.26,8.26 9.53,9.53 19.68,9.53 20.95,8.26 X1.38
N$12
  Top 0.305: C6.1 7.62,5.71 10.79,8.89 19.05,8.89 19.68,8.26 X1.37
N$13
  Top 0.305: X1.36 17.78,7.62 17.14,8.26 11.43,8.26 8.89,5.71 8.89,3.17 C5.1
N$14
  Top 0.305: C4.1 10.16,5.71 12.06,7.62 16.51,7.62 17.14,6.98 X1.35
SD0
  Bottom 0.305: IC2.11 31.11,54.61 32.38,55.88 32.38,57.78 33.02,58.42 36.2,58.42 38.1,60.33 46.35,60.33 51.44,65.41 CN1.P6
SD1  (via drill 0.6)
  Top 0.305: v50.16,67.94 50.16,69.22 51.44,70.48 CN1.P5
  Bottom 0.305: IC2.12 28.57,54.61 29.84,55.88 29.84,58.42 30.48,59.05 35.56,59.05 37.47,60.96 45.72,60.96 50.16,65.41 v50.16,67.94
SD2
  Bottom 0.305: CN1.P8 48.9,65.41 45.09,61.59 36.83,61.59 34.92,59.69 28.57,59.69 27.3,58.42 27.3,55.88 26.04,54.61 IC2.13
SD3  (via drill 0.6)
  Top 0.305: 48.9,70.48 47.62,69.22 v47.62,67.94
  Top 0.406: CN1.P7 48.9,70.48
  Bottom 0.305: IC2.14 23.5,54.61 24.77,55.88 24.77,58.42 25.4,59.05 26.67,59.05 27.94,60.33 34.29,60.33 36.2,62.23 44.45,62.23 47.62,65.41 v47.62,67.94
SD4
  Bottom 0.305: IC2.15 20.95,54.61 22.23,55.88 22.23,58.42 22.86,59.05 24.13,59.05 24.77,59.69 26.04,59.69 27.3,60.96 33.66,60.96 35.56,62.87 43.81,62.87 46.35,65.41 46.35,70.48
  Bottom 0.406: CN1.P10 46.35,70.48
SD5  (via drill 0.6)
  Top 0.305: 46.35,70.48 45.09,69.22 v45.09,67.94
  Top 0.406: CN1.P9 46.35,70.48
  Bottom 0.305: IC2.16 18.41,54.61 19.68,55.88 19.68,58.42 20.32,59.05 21.59,59.05 22.23,59.69 23.5,59.69 24.13,60.33 25.4,60.33 26.67,61.59 33.02,61.59 34.92,63.5 43.18,63.5 45.09,65.41 v45.09,67.94
SD6
  Bottom 0.305: IC2.17 15.88,54.61 17.14,55.88 17.14,58.42 17.78,59.05 19.05,59.05 19.68,59.69 20.95,59.69 21.59,60.33 22.86,60.33 23.5,60.96 24.77,60.96 26.04,62.23 32.38,62.23 34.29,64.14 42.55,64.14 43.81,65.41 43.81,70.48
  Bottom 0.406: CN1.P12 43.81,70.48
SD7  (via drill 0.6)
  Top 0.305: 43.81,70.48 42.55,69.22 v42.55,67.94
  Top 0.406: CN1.P11 43.81,70.48
  Bottom 0.305: IC2.18 13.34,54.61 14.61,55.88 14.61,58.42 15.24,59.05 16.51,59.05 17.14,59.69 18.41,59.69 19.05,60.33 20.32,60.33 20.95,60.96 22.23,60.96 22.86,61.59 24.13,61.59 25.4,62.87 31.75,62.87 33.66,64.77 41.91,64.77 42.55,65.41 v42.55,67.94
TERM_P
  Bottom 0.61: F1.2 47.62,27.94 46.35,26.67 RN2.1 46.35,22.86 45.72,22.23 D1.A 43.18,24.13 34.92,24.13 34.29,24.77 RN4.1
VCC
  Top 0.305: R2.1 4.45,64.77 7.62,62.23 14.61,62.23 15.88,60.96 31.11,60.96 | R6.1 5.08,35.56 6.99,37.47 6.99,40.01 5.71,41.27 JP1.1
  Top 0.406: IC1.1 31.11,60.96 IC1.20 | QG1'.4 65.84,56.32 62.87,53.98 | R5.1 6.35,32.38 R6.1
  Top 0.61: IC1.20 31.11,56.52 C2.1 | CN1.P4 C1.+ 53.98,64.77 56.52,62.23 56.52,53.98 59.05,53.98 | 59.05,53.98 59.05,36.2 | C3.1 59.05,36.2 | 59.05,36.2 56.52,36.2 IC2.40 56.52,33.66 53.98,31.11 F1.1 | QG1.14 62.87,53.98 59.05,53.98
  Bottom 0.305: 3.17,56.52 2.54,57.15 2.54,64.77 R2.1 | JP1.1 2.54,41.27 2.54,55.88 3.17,56.52 | 3.17,56.52 -LED+.1
  Bottom 0.406: C1.+ 46.35,59.05 38.1,59.05 36.83,57.78 34.92,57.78 C2.1
  Bottom 0.61: CN1.P4 C1.+

### Text on the board
Top: (c) KSR 2019 / krozycki@wp.pl / CDTV-SCSI ver.3.0
bValues: (c) KSR 2019 / krozycki@wp.pl / CDTV-SCSI ver. 3.0